# EAGLE design daq_pitot_tube_breakout (EAGLE 9.6.2)
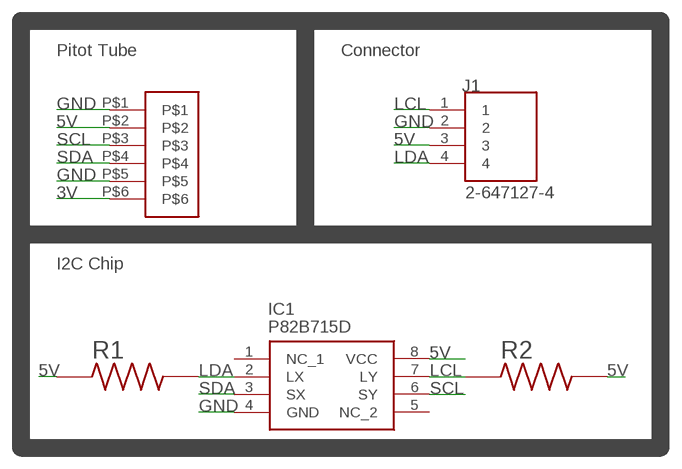
[diagram p0: schematic, sheet 1]

## Parts
IC1  P82B715D  [SOIC127P600X175-8N]
J1  2-647127-4  [TE_2-647127-4]
R1  RMCF1206JT10K0  [RESC3216X70N]
R2  RMCF1206JT10K0  [RESC3216X70N]
U$1  ASPD-4525  [ASPD-4525]

## Nets
3V: U$1.P$6
5V: IC1.8(VCC) J1.3 R1.1 R2.2 U$1.P$2
GND: IC1.4(GND) J1.2 U$1.P$1 U$1.P$5
LCL: IC1.7(LY) J1.1 R2.1
LDA: IC1.2(LX) J1.4 R1.2
SCL: IC1.6(SY) U$1.P$3
SDA: IC1.3(SX) U$1.P$4
Unconnected: IC1.1(NC_1) IC1.5(NC_2)

## Notes on the sheet
- Pitot Tube | Connector
- I2C Chip

## Library data of the parts
IC1 = SamacSys_Parts:P82B715D: Texas Instruments P82B715D, Dual, Bus Buffer, 4.5 12 V, 8-Pin SOIC Source: Datasheet <http://componentsearchengine.com/Datasheets/3/P82B715D.pdf>; DESCRIPTION: Texas Instruments P82B715D, Dual, Bus Buffer, 4.5 12 V, 8-Pin SOIC; HEIGHT: 1.75mm; MANUFACTURER_NAME: Texas Instruments; MANUFACTURER_PART_NUMBER: P82B715D; MOUSER_PART_NUMBER: 595-P82B715D; MOUSER_PRICE-STOCK: https://www.mouser.co.uk/ProductDetail/Texas-Instruments/P82B715D?qs=ToK3%2FczOkx%2Fmhyx%252Bp5%2FQZw%3D%3D
J1 = 2-647127-4:2-647127-4; CENTERLINE_PITCH: 3.96 mm[.156 in]; COMMENT: 2-647127-4; DESCRIPTION: 04P MTA156 SHRD HDR ASSY LF; DIGI-KEY_PART_NUMBER: A122823-ND; EU_ROHS_COMPLIANCE: Compliant; MF: TE Connectivity; MP: 2-647127-4; NUMBER_OF_POSITIONS: 4; PACKAGE: None; PRODUCT_TYPE: Header; PURCHASE-URL: https://pricing.snapeda.com/search/part/2-647127-4/?ref=eda
R1 R2 = RMCF1206JT10K0:RMCF1206JT10K0; DESCRIPTION: 10 kOhms ±5% 0.25W, 1/4W Chip Resistor 1206 (3216 Metric) Automotive AEC-Q200 Thick Film; DIGI-KEY_PART_NUMBER: RMCF1206JT10K0CT-ND; MF: Stackpole Electronics Inc; MP: RMCF1206JT10K0; PACKAGE: 3216 Stackpole; PURCHASE-URL: https://pricing.snapeda.com/search/part/RMCF1206JT10K0/?ref=eda
U$1 = ASPD-4525:ASPD-4525

## Board
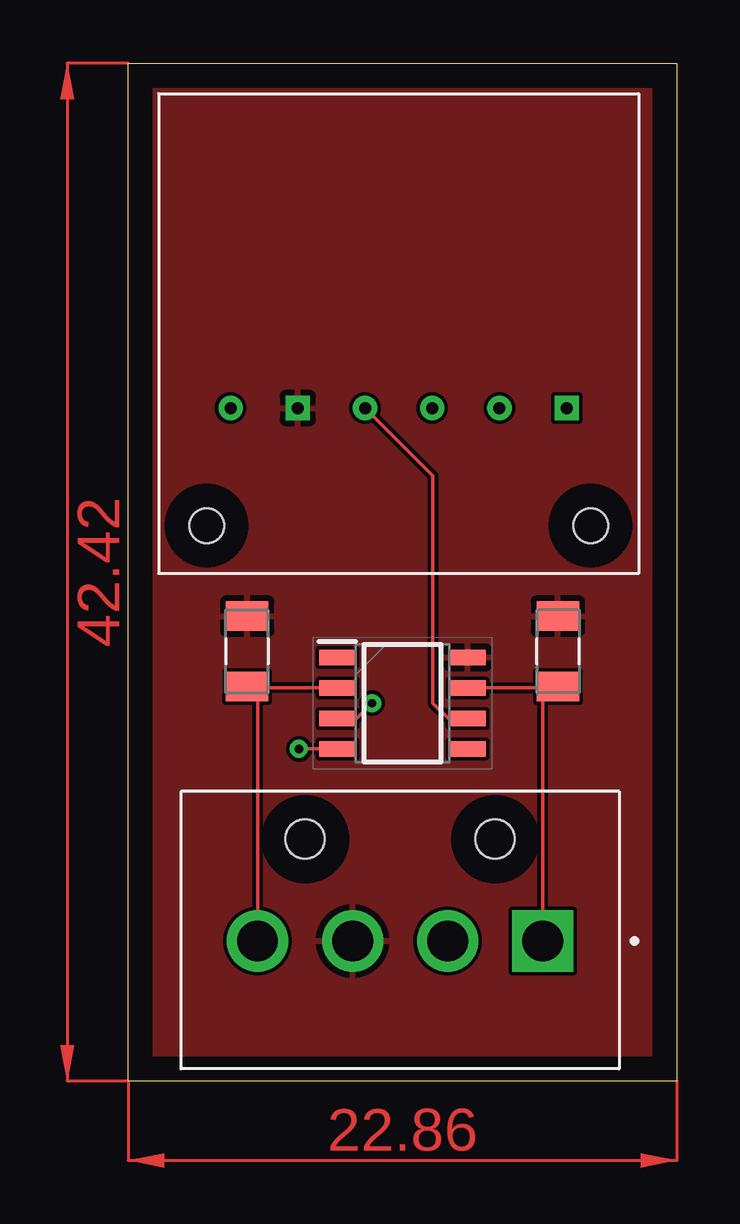
[diagram p1: board, top side]
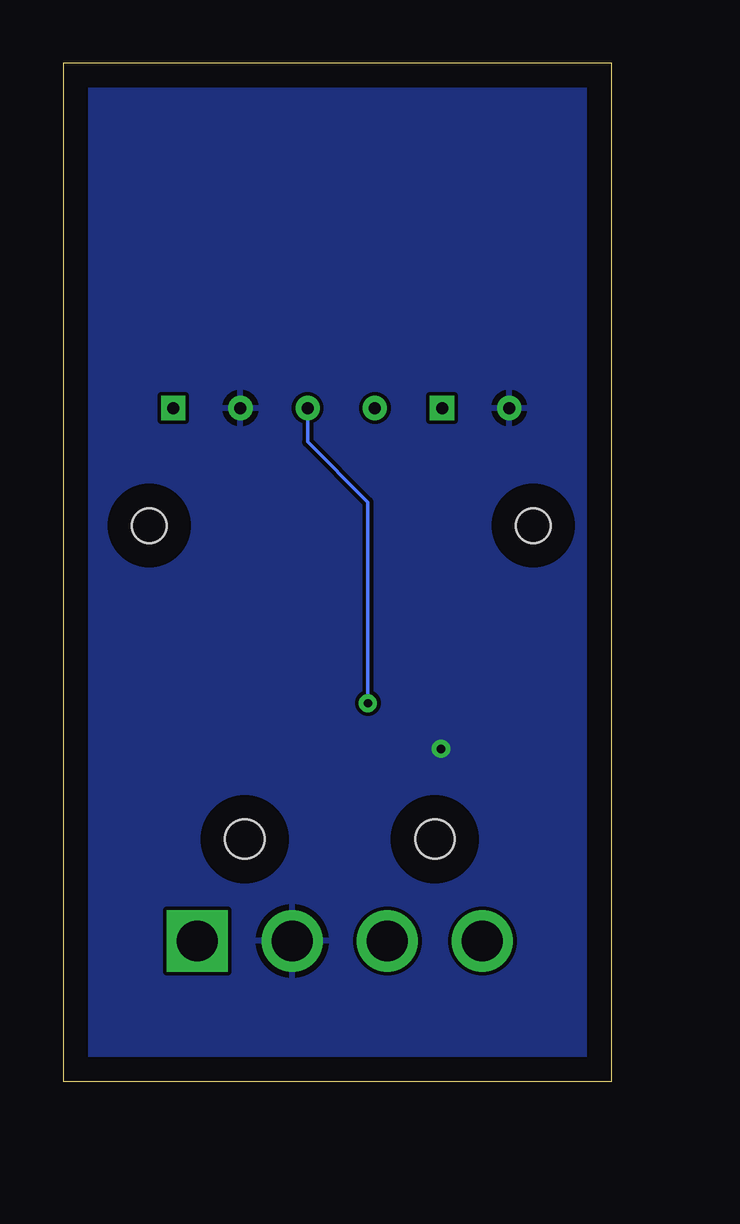
[diagram p2: board, bottom side, seen from below]

Size 22.86 x 42.42 mm. Coordinates in mm from the lower left corner, seen from the top.
Outline: 0,0 0,42.42 22.86,42.42 22.86,0 0,0
Copper layers (1*16): Top 0.035mm / dielectric 1.5mm / Bottom 0.035mm
Design rules "default": minimum track width 6mil, minimum drill 0.35mm, track to track 6mil, track to pad 6mil, pad to pad 6mil, via to via 6mil, smd to smd 6mil, copper to edge 40mil, drill to drill 6mil, minimum pad ring 10mil, minimum via ring 8mil, stop-mask expansion 4mil, vias tented up to drill 0mil, thermal gap 10mil

### Footprints (pad centres in the part's own frame; a part is rotated, then mirrored left to right if it is on the bottom)
SOIC127P600X175-8N = smd 1.525 x 0.65: 1 -2.712,1.905; 2 -2.712,0.635; 3 -2.712,-0.635; 4 -2.712,-1.905; 5 2.712,-1.905; 6 2.712,-0.635; 7 2.712,0.635; 8 2.712,1.905
TE_2-647127-4 = drill 1.7 pad 2.05 square: 1 0,0 | drill 1.7 pad 2.05: 2 -3.96,0; 3 -7.92,0; 4 -11.88,0 | hole 1.63: -9.9,4.24; -1.98,4.24
RESC3216X70N = smd 1.23 x 1.77: 1 -1.466,0; 2 1.466,0
ASPD-4525 = drill 0.5: P$1 3,-13.1; P$3 8.6,-13.1; P$4 11.4,-13.1; P$5 14.2,-13.1 | drill 0.5 square: P$2 5.8,-13.1; P$6 17,-13.1 | hole 1.44: 2,-18; 18,-18

### Placement (x,y rotation side)
IC1  11.43,15.75 0 top
J1  17.27,5.84 0 top
R1  4.95,17.91 270 top
R2  17.91,17.91 90 top
U$1  1.27,41.15 0 top

### Tracks (layer width: path | path; a pad name or v marks a point on that pad's centre or on a via)
5V
  pour Top: 0,0 0,42.42 22.86,42.42 22.86,0
GND  (via drill 0.35)
  Top 0.152: IC1.4 v7.11,13.84
  pour Bottom: 0,0 0,42.42 22.86,42.42 22.86,0
LCL
  Top 0.152: IC1.7 16.51,16.38 17.78,16.38 | 17.78,16.38 17.85,16.38 R2.1 | J1.1 17.27,15.88 17.78,16.38
LDA
  Top 0.152: IC1.2 5.08,16.38 | 5.08,16.38 5.01,16.38 R1.2 | 5.08,16.38 5.39,16.07 J1.4
SCL
  Top 0.152: U$1.P$3 12.7,25.22 12.7,15.75 13.34,15.11 IC1.6
SDA  (via drill 0.35)
  Top 0.152: IC1.3 9.53,15.11 v10.16,15.75
  Bottom 0.152: v10.16,15.75 10.16,24.13 12.67,26.64 U$1.P$4
(copper drawn outside any net)
  shapes: Top area x2